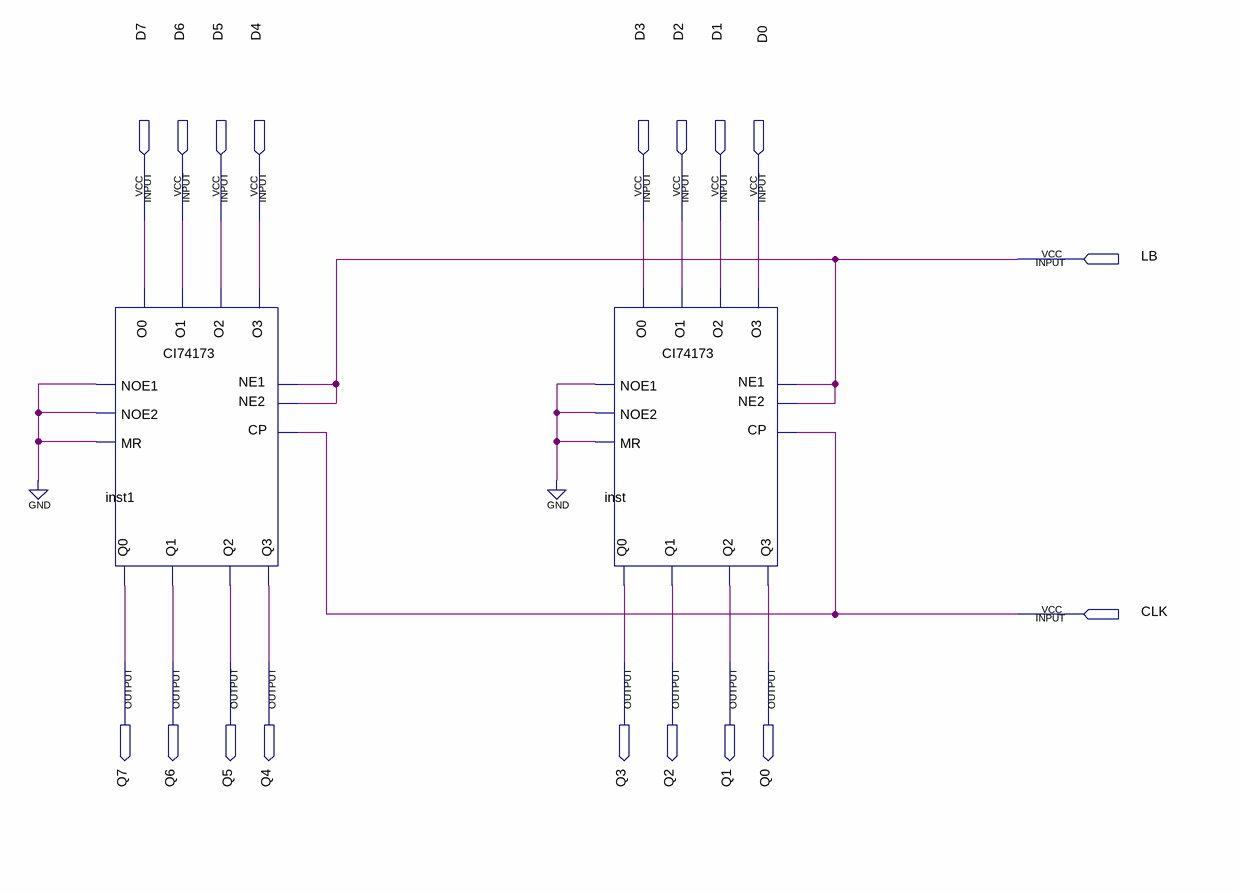
[diagram p0: schematic sheet]
// Quartus schematic RegistradorB.bdf as structural Verilog: 2 symbols, 18 pins
module RegistradorB (
  input  D7,
  input  D6,
  input  D5,
  input  D4,
  input  D3,
  input  D2,
  input  D1,
  input  D0,
  input  LB,
  input  CLK,
  output Q7,
  output Q6,
  output Q5,
  output Q4,
  output Q3,
  output Q2,
  output Q1,
  output Q0
);

  CI74173 inst1 (
    .O0(D7), .O1(D6), .O2(D5), .O3(D4), .NE1(LB), .NE2(LB), .CP(CLK), .MR(1'b0), .NOE1(1'b0), .NOE2(1'b0),
    .Q1(Q6), .Q2(Q5), .Q3(Q4), .Q0(Q7));
  CI74173 inst (
    .O0(D3), .O1(D2), .O2(D1), .O3(D0), .NE1(LB), .NE2(LB), .CP(CLK), .MR(1'b0), .NOE1(1'b0), .NOE2(1'b0),
    .Q1(Q2), .Q2(Q1), .Q3(Q0), .Q0(Q3));
endmodule
